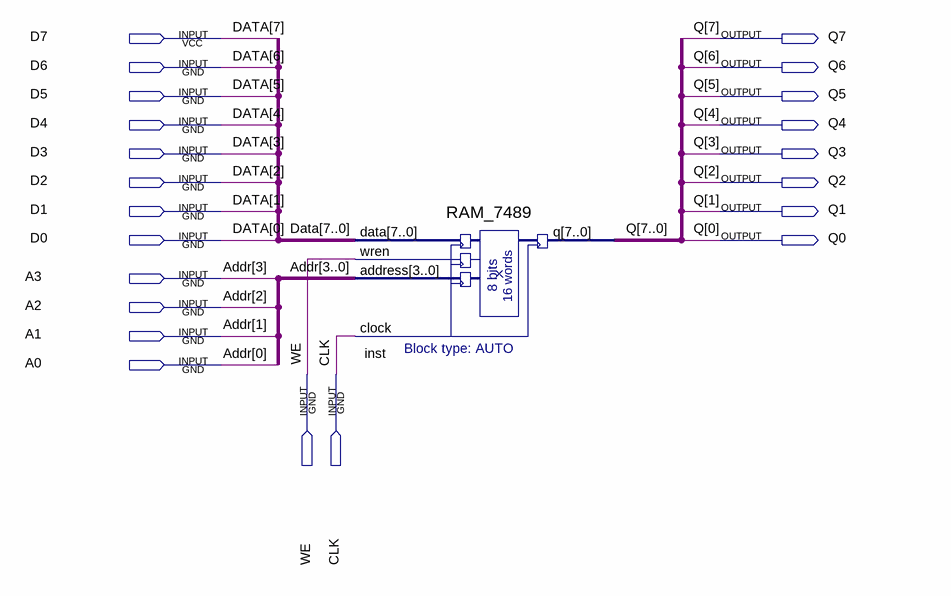
[diagram p0: schematic sheet]
// Quartus schematic RAM_7489_TEST.bdf as structural Verilog: 1 symbols, 22 pins
module RAM_7489_TEST (
  input  D7,
  input  D6,
  input  D5,
  input  D4,
  input  D3,
  input  D2,
  input  D1,
  input  D0,
  input  A3,
  input  A2,
  input  A1,
  input  A0,
  input  WE,
  input  CLK,
  output Q7,
  output Q6,
  output Q5,
  output Q4,
  output Q3,
  output Q2,
  output Q1,
  output Q0
);

  RAM_7489 inst (
    .data({D7, D6, D5, D4, D3, D2, D1, D0}), .wren(WE), .address({A3, A2, A1, A0}), .clock(CLK),
    .q({Q7, Q6, Q5, Q4, Q3, Q2, Q1, Q0}));

  // Other names for the same wires on the sheet: Addr[3:0] = {A3, A2, A1, A0};
  //   Data[7:0] = {D7, D6, D5, D4, D3, D2, D1, D0}
endmodule
